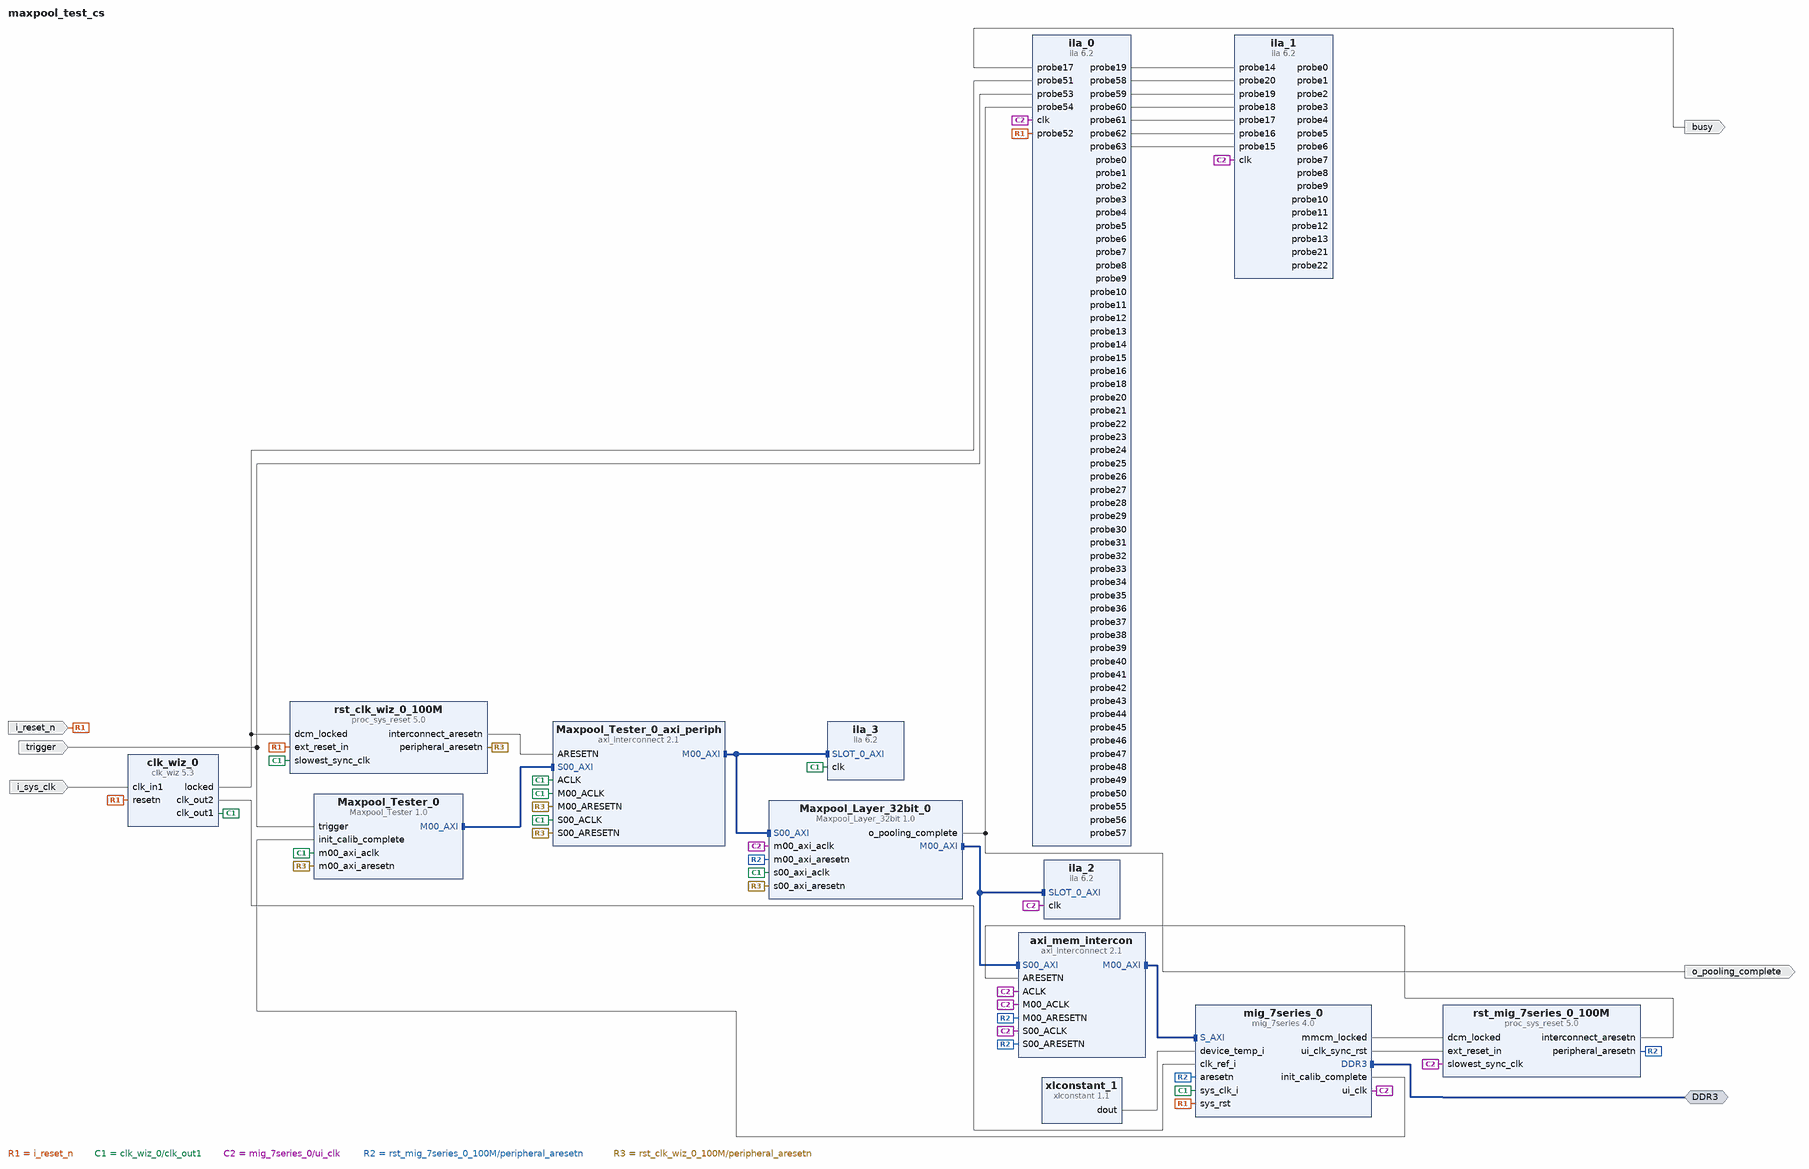
[diagram p0: block diagram of the top level]
# Vivado block design maxpool_test_cs, xc7a200tsbg484-1, Vivado 2016.4
create_bd_design maxpool_test_cs

create_bd_intf_port -mode Master -vlnv xilinx.com:interface:ddrx_rtl:1.0 DDR3
create_bd_port -dir I -type rst i_reset_n
set_property -dict {CONFIG.POLARITY ACTIVE_LOW} [get_bd_ports i_reset_n]
create_bd_port -dir I -type clk i_sys_clk
set_property -dict {CONFIG.FREQ_HZ 100000000 CONFIG.PHASE 0.000} [get_bd_ports i_sys_clk]
create_bd_port -dir I -type intr trigger
create_bd_port -dir O o_pooling_complete
create_bd_port -dir O busy

create_bd_cell -type ip -vlnv xilinx.com:ip:mig_7series:4.0 mig_7series_0
set_property -dict [list \
  CONFIG.XML_INPUT_FILE mig_a.prj \
  CONFIG.RESET_BOARD_INTERFACE Custom \
  CONFIG.BOARD_MIG_PARAM Custom \
] [get_bd_cells mig_7series_0]
create_bd_cell -type ip -vlnv xilinx.com:ip:clk_wiz:5.3 clk_wiz_0
set_property -dict [list \
  CONFIG.CLKOUT2_USED true \
  CONFIG.NUM_OUT_CLKS 2 \
  CONFIG.CLKOUT2_REQUESTED_OUT_FREQ 200.000 \
  CONFIG.RESET_PORT resetn \
  CONFIG.MMCM_DIVCLK_DIVIDE 1 \
  CONFIG.MMCM_CLKOUT1_DIVIDE 5 \
  CONFIG.RESET_TYPE ACTIVE_LOW \
  CONFIG.CLKOUT2_JITTER 114.829 \
  CONFIG.CLKOUT2_PHASE_ERROR 98.575 \
] [get_bd_cells clk_wiz_0]
create_bd_cell -type ip -vlnv xilinx.com:ip:ila:6.2 ila_0
set_property -dict [list \
  CONFIG.C_PROBE63_WIDTH 32 \
  CONFIG.C_PROBE61_WIDTH 8 \
  CONFIG.C_PROBE60_WIDTH 3 \
  CONFIG.C_PROBE59_WIDTH 32 \
  CONFIG.C_PROBE57_WIDTH 4 \
  CONFIG.C_PROBE56_WIDTH 4 \
  CONFIG.C_PROBE45_WIDTH 32 \
  CONFIG.C_PROBE31_WIDTH 1 \
  CONFIG.C_PROBE30_WIDTH 1 \
  CONFIG.C_PROBE27_WIDTH 1 \
  CONFIG.C_PROBE26_WIDTH 1 \
  CONFIG.C_PROBE25_WIDTH 1 \
  CONFIG.C_PROBE24_WIDTH 1 \
  CONFIG.C_PROBE18_WIDTH 4 \
  CONFIG.C_PROBE15_WIDTH 1 \
  CONFIG.C_PROBE14_WIDTH 16 \
  CONFIG.C_PROBE13_WIDTH 8 \
  CONFIG.C_PROBE12_WIDTH 8 \
  CONFIG.C_PROBE11_WIDTH 8 \
  CONFIG.C_PROBE9_WIDTH 4 \
  CONFIG.C_PROBE7_WIDTH 16 \
  CONFIG.C_PROBE6_WIDTH 8 \
  CONFIG.C_PROBE5_WIDTH 8 \
  CONFIG.C_NUM_OF_PROBES 64 \
  CONFIG.C_ENABLE_ILA_AXI_MON false \
  CONFIG.C_MONITOR_TYPE Native \
] [get_bd_cells ila_0]
create_bd_cell -type ip -vlnv xilinx.com:ip:xlconstant:1.1 xlconstant_1
set_property -dict {CONFIG.CONST_WIDTH 12 CONFIG.CONST_VAL 1} [get_bd_cells xlconstant_1]
create_bd_cell -type ip -vlnv xilinx.com:ip:axi_interconnect:2.1 axi_mem_intercon
set_property -dict {CONFIG.NUM_MI 1} [get_bd_cells axi_mem_intercon]
create_bd_cell -type ip -vlnv xilinx.com:ip:proc_sys_reset:5.0 rst_mig_7series_0_100M
create_bd_cell -type ip -vlnv xilinx.com:ip:axi_interconnect:2.1 Maxpool_Tester_0_axi_periph
set_property -dict {CONFIG.NUM_MI 1} [get_bd_cells Maxpool_Tester_0_axi_periph]
create_bd_cell -type ip -vlnv xilinx.com:ip:proc_sys_reset:5.0 rst_clk_wiz_0_100M
create_bd_cell -type ip -vlnv xilinx.com:ip:ila:6.2 ila_2
create_bd_cell -type ip -vlnv xilinx.com:ip:ila:6.2 ila_1
set_property -dict [list \
  CONFIG.C_PROBE22_WIDTH 9 \
  CONFIG.C_PROBE19_WIDTH 32 \
  CONFIG.C_PROBE18_WIDTH 3 \
  CONFIG.C_PROBE17_WIDTH 8 \
  CONFIG.C_PROBE15_WIDTH 32 \
  CONFIG.C_PROBE11_WIDTH 32 \
  CONFIG.C_PROBE7_WIDTH 8 \
  CONFIG.C_PROBE6_WIDTH 32 \
  CONFIG.C_PROBE5_WIDTH 3 \
  CONFIG.C_PROBE2_WIDTH 4 \
  CONFIG.C_NUM_OF_PROBES 23 \
  CONFIG.C_ENABLE_ILA_AXI_MON false \
  CONFIG.C_MONITOR_TYPE Native \
] [get_bd_cells ila_1]
create_bd_cell -type ip -vlnv xilinx.com:ip:ila:6.2 ila_3
create_bd_cell -type ip -vlnv xilinx.com:user:Maxpool_Tester:1.0 Maxpool_Tester_0
create_bd_cell -type ip -vlnv xilinx.com:user:Maxpool_Layer_32bit:1.0 Maxpool_Layer_32bit_0

# ---- connections ----

connect_bd_intf_net [get_bd_intf_pins Maxpool_Tester_0_axi_periph/M00_AXI] [get_bd_intf_pins Maxpool_Layer_32bit_0/S00_AXI]
connect_bd_intf_net [get_bd_intf_pins Maxpool_Tester_0_axi_periph/M00_AXI] [get_bd_intf_pins ila_3/SLOT_0_AXI]
connect_bd_intf_net [get_bd_intf_pins Maxpool_Layer_32bit_0/M00_AXI] [get_bd_intf_pins axi_mem_intercon/S00_AXI]
connect_bd_intf_net [get_bd_intf_pins Maxpool_Layer_32bit_0/M00_AXI] [get_bd_intf_pins ila_2/SLOT_0_AXI]
connect_bd_intf_net [get_bd_intf_pins axi_mem_intercon/M00_AXI] [get_bd_intf_pins mig_7series_0/S_AXI]
connect_bd_intf_net [get_bd_intf_pins Maxpool_Tester_0/M00_AXI] [get_bd_intf_pins Maxpool_Tester_0_axi_periph/S00_AXI]
connect_bd_intf_net [get_bd_intf_ports DDR3] [get_bd_intf_pins mig_7series_0/DDR3]
connect_bd_net [get_bd_pins clk_wiz_0/locked] [get_bd_pins rst_clk_wiz_0_100M/dcm_locked] [get_bd_pins ila_0/probe51]
connect_bd_net -net reset_rtl_0_1 [get_bd_ports i_reset_n] \
  [get_bd_pins mig_7series_0/sys_rst] [get_bd_pins clk_wiz_0/resetn] [get_bd_pins rst_clk_wiz_0_100M/ext_reset_in] \
  [get_bd_pins ila_0/probe52]
connect_bd_net -net clock_rtl_1 [get_bd_ports i_sys_clk] [get_bd_pins clk_wiz_0/clk_in1]
connect_bd_net [get_bd_pins mig_7series_0/init_calib_complete] [get_bd_pins Maxpool_Tester_0/init_calib_complete]
connect_bd_net [get_bd_pins clk_wiz_0/clk_out2] [get_bd_pins mig_7series_0/clk_ref_i]
connect_bd_net [get_bd_pins xlconstant_1/dout] [get_bd_pins mig_7series_0/device_temp_i]
connect_bd_net [get_bd_ports trigger] [get_bd_pins ila_0/probe53] [get_bd_pins Maxpool_Tester_0/trigger]
connect_bd_net [get_bd_pins Maxpool_Layer_32bit_0/o_pooling_complete] [get_bd_ports o_pooling_complete] [get_bd_pins ila_0/probe54]
connect_bd_net [get_bd_pins clk_wiz_0/clk_out1] \
  [get_bd_pins rst_clk_wiz_0_100M/slowest_sync_clk] [get_bd_pins mig_7series_0/sys_clk_i] [get_bd_pins ila_3/clk] \
  [get_bd_pins Maxpool_Tester_0/m00_axi_aclk] [get_bd_pins Maxpool_Tester_0_axi_periph/S00_ACLK] \
  [get_bd_pins Maxpool_Tester_0_axi_periph/ACLK] [get_bd_pins Maxpool_Tester_0_axi_periph/M00_ACLK] \
  [get_bd_pins Maxpool_Layer_32bit_0/s00_axi_aclk]
connect_bd_net [get_bd_pins mig_7series_0/ui_clk] \
  [get_bd_pins rst_mig_7series_0_100M/slowest_sync_clk] [get_bd_pins ila_0/clk] [get_bd_pins ila_2/clk] \
  [get_bd_pins ila_1/clk] [get_bd_pins axi_mem_intercon/S00_ACLK] [get_bd_pins axi_mem_intercon/ACLK] \
  [get_bd_pins axi_mem_intercon/M00_ACLK] [get_bd_pins Maxpool_Layer_32bit_0/m00_axi_aclk]
connect_bd_net [get_bd_pins mig_7series_0/mmcm_locked] [get_bd_pins rst_mig_7series_0_100M/dcm_locked]
connect_bd_net [get_bd_pins mig_7series_0/ui_clk_sync_rst] [get_bd_pins rst_mig_7series_0_100M/ext_reset_in]
connect_bd_net [get_bd_pins rst_mig_7series_0_100M/peripheral_aresetn] \
  [get_bd_pins mig_7series_0/aresetn] [get_bd_pins axi_mem_intercon/S00_ARESETN] [get_bd_pins axi_mem_intercon/M00_ARESETN] \
  [get_bd_pins Maxpool_Layer_32bit_0/m00_axi_aresetn]
connect_bd_net [get_bd_pins rst_mig_7series_0_100M/interconnect_aresetn] [get_bd_pins axi_mem_intercon/ARESETN]
connect_bd_net [get_bd_pins rst_clk_wiz_0_100M/peripheral_aresetn] \
  [get_bd_pins Maxpool_Tester_0/m00_axi_aresetn] [get_bd_pins Maxpool_Tester_0_axi_periph/S00_ARESETN] \
  [get_bd_pins Maxpool_Tester_0_axi_periph/M00_ARESETN] [get_bd_pins Maxpool_Layer_32bit_0/s00_axi_aresetn]
connect_bd_net [get_bd_pins rst_clk_wiz_0_100M/interconnect_aresetn] [get_bd_pins Maxpool_Tester_0_axi_periph/ARESETN]
# net Maxpool_Layer_32bit_0_ila_mp_third_row_activate has one end: ila_0/probe0
# net Maxpool_Layer_32bit_0_ila_mp_recycle_en has one end: ila_0/probe1
# net Maxpool_Layer_32bit_0_ila_mp_prime_PR0_en has one end: ila_0/probe2
# net Maxpool_Layer_32bit_0_ila_mp_prime_PR1_en has one end: ila_0/probe3
# net Maxpool_Layer_32bit_0_ila_mp_prime_PR2_en has one end: ila_0/probe4
# net Maxpool_Layer_32bit_0_ila_mp_pixel_counter has one end: ila_0/probe5
# net Maxpool_Layer_32bit_0_ila_mp_column_counter has one end: ila_0/probe6
# net Maxpool_Layer_32bit_0_ila_mp_row_counter has one end: ila_0/probe7
# net Maxpool_Layer_32bit_0_ila_mp_sorter_data_valid has one end: ila_0/probe8
# net Maxpool_Layer_32bit_0_ila_mp_stride_counter has one end: ila_0/probe9
# net Maxpool_Layer_32bit_0_ila_mp_volume_processed has one end: ila_0/probe10
# net Maxpool_Layer_32bit_0_ila_mp_volume_rows_processed has one end: ila_0/probe11
# net Maxpool_Layer_32bit_0_ila_mp_output_rows_generated has one end: ila_0/probe12
# net Maxpool_Layer_32bit_0_ila_mp_output_volume_size has one end: ila_0/probe13
# net Maxpool_Layer_32bit_0_ila_mp_channel_counter has one end: ila_0/probe14
# net Maxpool_Layer_32bit_0_ila_mp_channel_complete has one end: ila_0/probe15
# net Maxpool_Layer_32bit_0_ila_mp_row_complete has one end: ila_0/probe16
connect_bd_net -net Maxpool_Layer_32bit_0_ila_mp_busy [get_bd_ports busy] [get_bd_pins ila_0/probe17]
# net Maxpool_Layer_32bit_0_ila_mp_fsm_state has one end: ila_0/probe18
connect_bd_net -net Maxpool_Layer_32bit_0_ila_mp_PR0_wr_en [get_bd_pins ila_0/probe19] [get_bd_pins ila_1/probe14]
# net Maxpool_Layer_32bit_0_ila_mp_PR0_rd_en has one end: ila_0/probe20
# net Maxpool_Layer_32bit_0_ila_mp_PR0_full has one end: ila_0/probe21
# net Maxpool_Layer_32bit_0_ila_mp_PR0_almost_full has one end: ila_0/probe22
# net Maxpool_Layer_32bit_0_ila_mp_PR0_empty has one end: ila_0/probe23
# net Maxpool_Layer_32bit_0_ila_mp_PR0_almost_empty has one end: ila_0/probe24
# net Maxpool_Layer_32bit_0_ila_mp_PR1_wr_en has one end: ila_0/probe25
# net Maxpool_Layer_32bit_0_ila_mp_PR1_rd_en has one end: ila_0/probe26
# net Maxpool_Layer_32bit_0_ila_mp_PR1_full has one end: ila_0/probe27
# net Maxpool_Layer_32bit_0_ila_mp_PR1_almost_full has one end: ila_0/probe28
# net Maxpool_Layer_32bit_0_ila_mp_PR1_empty has one end: ila_0/probe29
# net Maxpool_Layer_32bit_0_ila_mp_PR1_almost_empty has one end: ila_0/probe30
# net Maxpool_Layer_32bit_0_ila_mp_PR2_wr_en has one end: ila_0/probe31
# net Maxpool_Layer_32bit_0_ila_mp_PR2_rd_en has one end: ila_0/probe32
# net Maxpool_Layer_32bit_0_ila_mp_PR2_full has one end: ila_0/probe33
# net Maxpool_Layer_32bit_0_ila_mp_PR2_almost_full has one end: ila_0/probe34
# net Maxpool_Layer_32bit_0_ila_mp_PR2_empty has one end: ila_0/probe35
# net Maxpool_Layer_32bit_0_ila_mp_PR2_almost_empty has one end: ila_0/probe36
# net Maxpool_Layer_32bit_0_ila_mp_inbuff_wr_en has one end: ila_0/probe37
# net Maxpool_Layer_32bit_0_ila_mp_inbuff_empty has one end: ila_0/probe38
# net Maxpool_Layer_32bit_0_ila_mp_inbuff_almost_empty has one end: ila_0/probe39
# net Maxpool_Layer_32bit_0_ila_mp_inbuff_full has one end: ila_0/probe40
# net Maxpool_Layer_32bit_0_ila_mp_inbuff_almost_full has one end: ila_0/probe41
# net Maxpool_Layer_32bit_0_ila_mp_inbuff_valid has one end: ila_0/probe42
# net Maxpool_Layer_32bit_0_ila_mp_inbuff_rd_en has one end: ila_0/probe43
# net Maxpool_Layer_32bit_0_ila_mp_outbuff_rd_en has one end: ila_0/probe44
# net Maxpool_Layer_32bit_0_ila_mp_outbuff_dout has one end: ila_0/probe45
# net Maxpool_Layer_32bit_0_ila_mp_outbuff_empty has one end: ila_0/probe46
# net Maxpool_Layer_32bit_0_ila_mp_outbuff_almost_empty has one end: ila_0/probe47
# net Maxpool_Layer_32bit_0_ila_mp_outbuff_full has one end: ila_0/probe48
# net Maxpool_Layer_32bit_0_ila_mp_outbuff_almost_full has one end: ila_0/probe49
# net Maxpool_Layer_32bit_0_ila_mp_outbuff_valid has one end: ila_0/probe50
# net Maxpool_Layer_32bit_0_ila_mp_sorter_ready has one end: ila_0/probe55
# net Maxpool_Layer_32bit_0_ila_mp_sorter_fsm_state has one end: ila_0/probe56
# net Maxpool_Layer_32bit_0_ila_mp_master_fsm_state has one end: ila_0/probe57
connect_bd_net -net Maxpool_Layer_32bit_0_ila_mp_m_axi_awready [get_bd_pins ila_0/probe58] [get_bd_pins ila_1/probe20]
connect_bd_net -net Maxpool_Layer_32bit_0_ila_mp_m_axi_awaddr [get_bd_pins ila_0/probe59] [get_bd_pins ila_1/probe19]
connect_bd_net -net Maxpool_Layer_32bit_0_ila_mp_m_axi_awsize [get_bd_pins ila_0/probe60] [get_bd_pins ila_1/probe18]
connect_bd_net -net Maxpool_Layer_32bit_0_ila_mp_m_axi_awlen [get_bd_pins ila_0/probe61] [get_bd_pins ila_1/probe17]
connect_bd_net -net Maxpool_Layer_32bit_0_ila_mp_m_axi_awvalid [get_bd_pins ila_0/probe62] [get_bd_pins ila_1/probe16]
connect_bd_net -net Maxpool_Layer_32bit_0_ila_mp_m_axi_wdata [get_bd_pins ila_0/probe63] [get_bd_pins ila_1/probe15]
# net Maxpool_Layer_32bit_0_ila_mp_m_axi_wlast has one end: ila_1/probe0
# net Maxpool_Layer_32bit_0_ila_mp_m_axi_wvalid has one end: ila_1/probe1
# net Maxpool_Layer_32bit_0_ila_mp_m_axi_wstrb has one end: ila_1/probe2
# net Maxpool_Layer_32bit_0_ila_mp_m_axi_bvalid has one end: ila_1/probe3
# net Maxpool_Layer_32bit_0_ila_mp_m_axi_bready has one end: ila_1/probe4
# net Maxpool_Layer_32bit_0_ila_mp_m_axi_arsize has one end: ila_1/probe5
# net Maxpool_Layer_32bit_0_ila_mp_m_axi_araddr has one end: ila_1/probe6
# net Maxpool_Layer_32bit_0_ila_mp_m_axi_arlen has one end: ila_1/probe7
# net Maxpool_Layer_32bit_0_ila_mp_m_axi_arvalid has one end: ila_1/probe8
# net Maxpool_Layer_32bit_0_ila_mp_m_axi_rready has one end: ila_1/probe9
# net Maxpool_Layer_32bit_0_ila_mp_m_axi_arready has one end: ila_1/probe10
# net Maxpool_Layer_32bit_0_ila_mp_m_axi_rdata has one end: ila_1/probe11
# net Maxpool_Layer_32bit_0_ila_mp_m_axi_rlast has one end: ila_1/probe12
# net Maxpool_Layer_32bit_0_ila_mp_m_axi_rvalid has one end: ila_1/probe13
# net Maxpool_Layer_32bit_0_ila_mp_m_axi_wready has one end: ila_1/probe21
# net Maxpool_Layer_32bit_0_ila_mp_m_axi_wbc has one end: ila_1/probe22

# ---- address map ----
assign_bd_address -offset 0x80000000 -range 512M -target_address_space [get_bd_addr_spaces Maxpool_Layer_32bit_0/M00_AXI] [get_bd_addr_segs mig_7series_0/memmap/memaddr]
assign_bd_address -offset 0x44A00000 -range 64K -target_address_space [get_bd_addr_spaces Maxpool_Tester_0/M00_AXI] [get_bd_addr_segs Maxpool_Layer_32bit_0/S00_AXI/S00_AXI_reg]

validate_bd_design
save_bd_design
